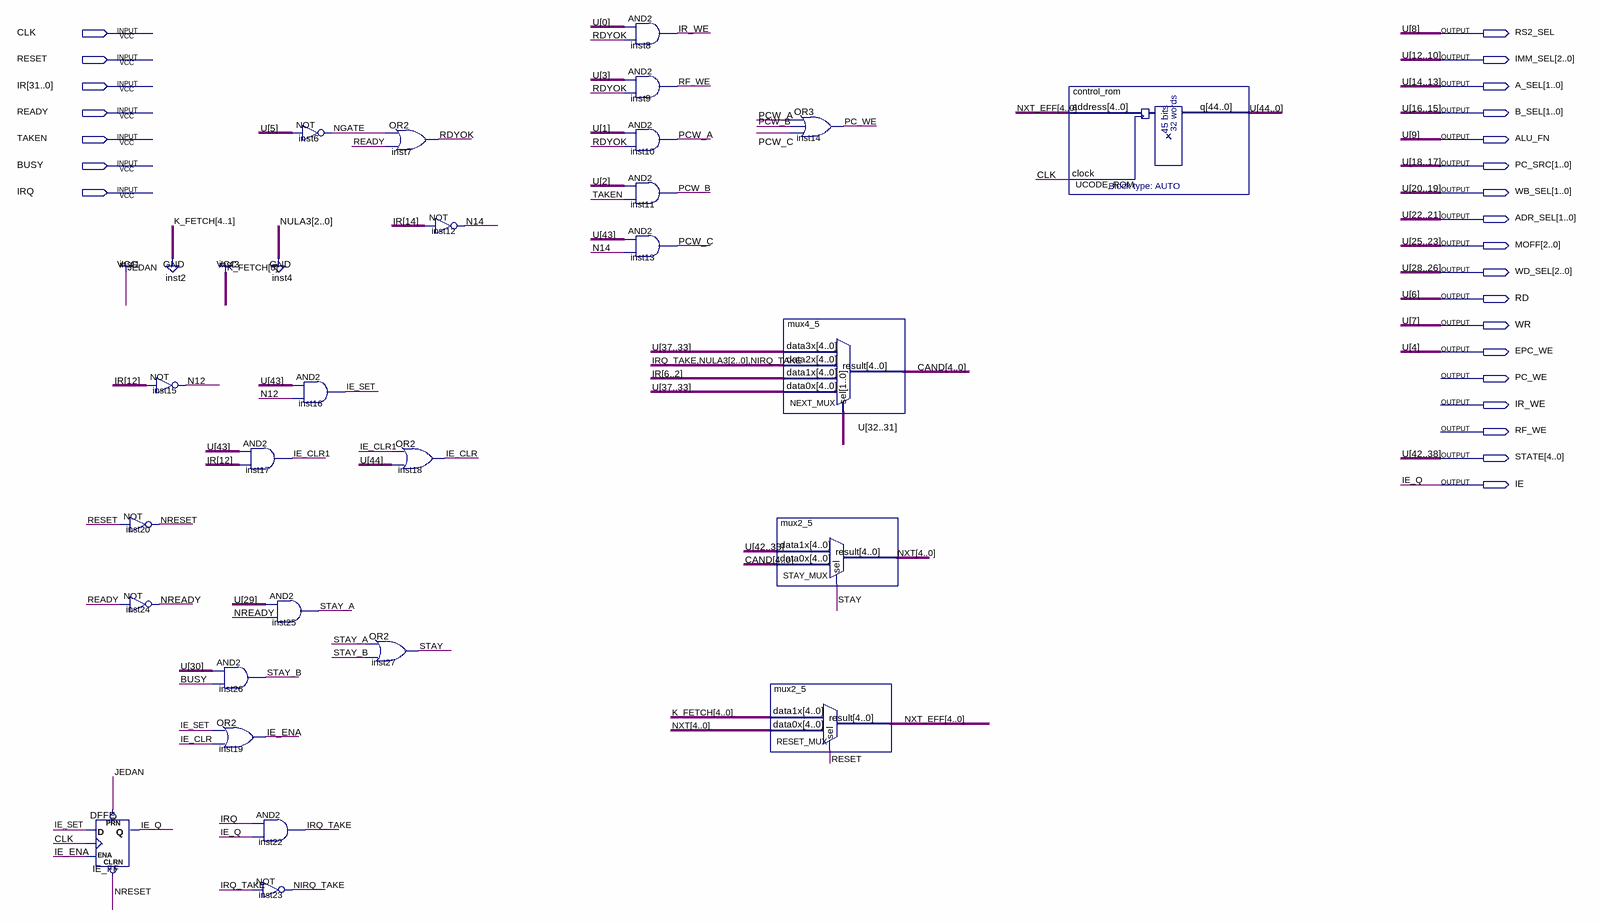
[diagram p0: schematic sheet]
// Quartus schematic instruction_decoder.bdf as structural Verilog: 26 symbols, 25 pins
module instruction_decoder (
  input  CLK,
  input  RESET,
  input  [31:0] IR,
  input  READY,
  input  TAKEN,
  input  BUSY,
  input  IRQ,
  output RS2_SEL,
  output [2:0] IMM_SEL,
  output [1:0] A_SEL,
  output [1:0] B_SEL,
  output ALU_FN,
  output [1:0] PC_SRC,
  output [1:0] WB_SEL,
  output [1:0] ADR_SEL,
  output [2:0] MOFF,
  output [2:0] WD_SEL,
  output RD,
  output WR,
  output EPC_WE,
  output PC_WE,
  output IR_WE,
  output RF_WE,
  output [4:0] STATE,
  output IE
);

  wire IE_CLR, IE_CLR1, IE_ENA, IE_SET, IRQ_TAKE, N12, N14, NGATE, NIRQ_TAKE, NREADY, NRESET, PCW_A, PCW_B,
       PCW_C, RDYOK, STAY, STAY_A, STAY_B;
  wire [4:0] CAND, NXT, NXT_EFF;
  wire [44:0] U;

  DFFE IE_FF (.PRN(1'b1), .CLRN(NRESET), .D(IE_SET), .CLK(CLK), .ENA(IE_ENA), .Q(IE));
  not inst15 (N12, IR[12]);
  not inst20 (NRESET, RESET);
  not inst24 (NREADY, READY);
  and inst26 (STAY_B, U[30], BUSY);
  or inst19 (IE_ENA, IE_SET, IE_CLR);
  and inst17 (IE_CLR1, U[43], IR[12]);
  and inst25 (STAY_A, U[29], NREADY);
  and inst22 (IRQ_TAKE, IRQ, IE);
  not inst23 (NIRQ_TAKE, IRQ_TAKE);
  not inst6 (NGATE, U[5]);
  and inst16 (IE_SET, U[43], N12);
  or inst27 (STAY, STAY_A, STAY_B);
  or inst7 (RDYOK, NGATE, READY);
  not inst12 (N14, IR[14]);
  or inst18 (IE_CLR, IE_CLR1, U[44]);
  and inst8 (IR_WE, U[0], RDYOK);
  and inst9 (RF_WE, U[3], RDYOK);
  and inst10 (PCW_A, U[1], RDYOK);
  and inst11 (PCW_B, U[2], TAKEN);
  and inst13 (PCW_C, U[43], N14);
  or inst14 (PC_WE, PCW_A, PCW_B, PCW_C);
  mux4_5 NEXT_MUX (
    .data3x(U[37:33]), .data2x({IRQ_TAKE, 3'b000, NIRQ_TAKE}), .data1x(IR[6:2]), .data0x(U[37:33]),
    .sel(U[32:31]), .result(CAND));
  mux2_5 STAY_MUX (.data1x(STATE), .data0x(CAND), .sel(STAY), .result(NXT));
  mux2_5 RESET_MUX (.data1x(5'b00001), .data0x(NXT), .sel(RESET), .result(NXT_EFF));
  control_rom UCODE_ROM (
    .address(NXT_EFF), .clock(CLK),
    .q({U[44:43], STATE, U[37:29], WD_SEL, MOFF, ADR_SEL, WB_SEL, PC_SRC, B_SEL, A_SEL, IMM_SEL, ALU_FN, RS2_SEL, WR, RD, U[5], EPC_WE, U[3:0]}));

  // Other names for the same wires on the sheet: IE_Q = IE;
  //   U (some bits) = {STATE, WD_SEL, MOFF, ADR_SEL, WB_SEL, PC_SRC, B_SEL, A_SEL, IMM_SEL, ALU_FN, RS2_SEL, WR, RD, EPC_WE}
endmodule
